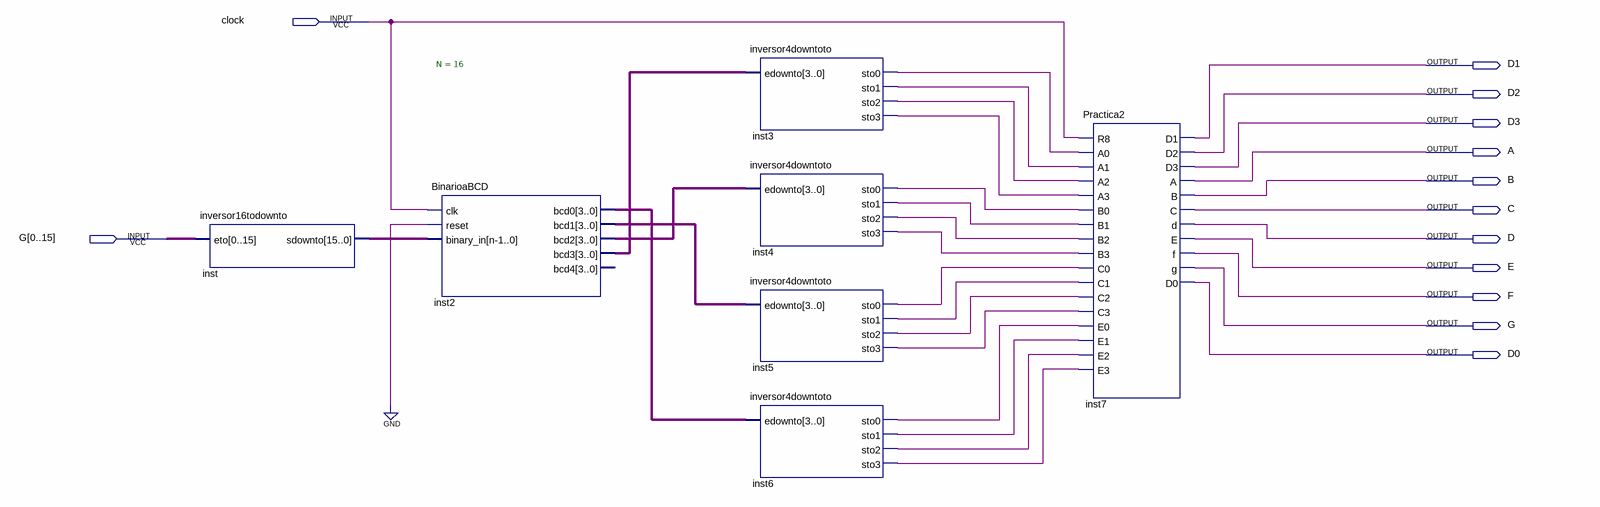
[diagram p0: schematic sheet]
// Quartus schematic Protoboard.bdf as structural Verilog: 7 symbols, 13 pins
module Protoboard (
  input  clock,
  input  [0:15] G,
  output D1,
  output D2,
  output D3,
  output A,
  output B,
  output C,
  output D,
  output E,
  output F,
  output G_1bit,
  output D0
);

  wire inst3_sto0, inst3_sto1, inst3_sto2, inst3_sto3, inst4_sto0, inst4_sto1, inst4_sto2, inst4_sto3,
       inst5_sto0, inst5_sto1, inst5_sto2, inst5_sto3, inst6_sto0, inst6_sto1, inst6_sto2, inst6_sto3;
  wire [3:0] inst2_bcd0, inst2_bcd1, inst2_bcd2, inst2_bcd3;
  wire [15:0] inst_sdownto;

  inversor16todownto inst (.eto(G), .sdownto(inst_sdownto));
  BinarioaBCD #(.N(16)) inst2 (
    .clk(clock), .reset(1'b0), .binary_in(inst_sdownto), .bcd0(inst2_bcd0), .bcd1(inst2_bcd1),
    .bcd2(inst2_bcd2), .bcd3(inst2_bcd3));  // open: bcd4
  inversor4downtoto inst3 (
    .edownto(inst2_bcd3), .sto0(inst3_sto0), .sto1(inst3_sto1), .sto2(inst3_sto2), .sto3(inst3_sto3));
  inversor4downtoto inst4 (
    .edownto(inst2_bcd2), .sto0(inst4_sto0), .sto1(inst4_sto1), .sto2(inst4_sto2), .sto3(inst4_sto3));
  inversor4downtoto inst5 (
    .edownto(inst2_bcd1), .sto0(inst5_sto0), .sto1(inst5_sto1), .sto2(inst5_sto2), .sto3(inst5_sto3));
  inversor4downtoto inst6 (
    .edownto(inst2_bcd0), .sto0(inst6_sto0), .sto1(inst6_sto1), .sto2(inst6_sto2), .sto3(inst6_sto3));
  Practica2 inst7 (
    .R8(clock), .A0(inst3_sto0), .A1(inst3_sto1), .A2(inst3_sto2), .A3(inst3_sto3), .B0(inst4_sto0),
    .B1(inst4_sto1), .B2(inst4_sto2), .B3(inst4_sto3), .C0(inst5_sto0), .C1(inst5_sto1), .C2(inst5_sto2),
    .C3(inst5_sto3), .E0(inst6_sto0), .E1(inst6_sto1), .E2(inst6_sto2), .E3(inst6_sto3), .D1(D1), .D2(D2),
    .D3(D3), .A(A), .B(B), .C(C), .d(D), .E(E), .f(F), .g(G_1bit), .D0(D0));
endmodule
